# EAGLE design placa-endstops (EAGLE 9.6.0)
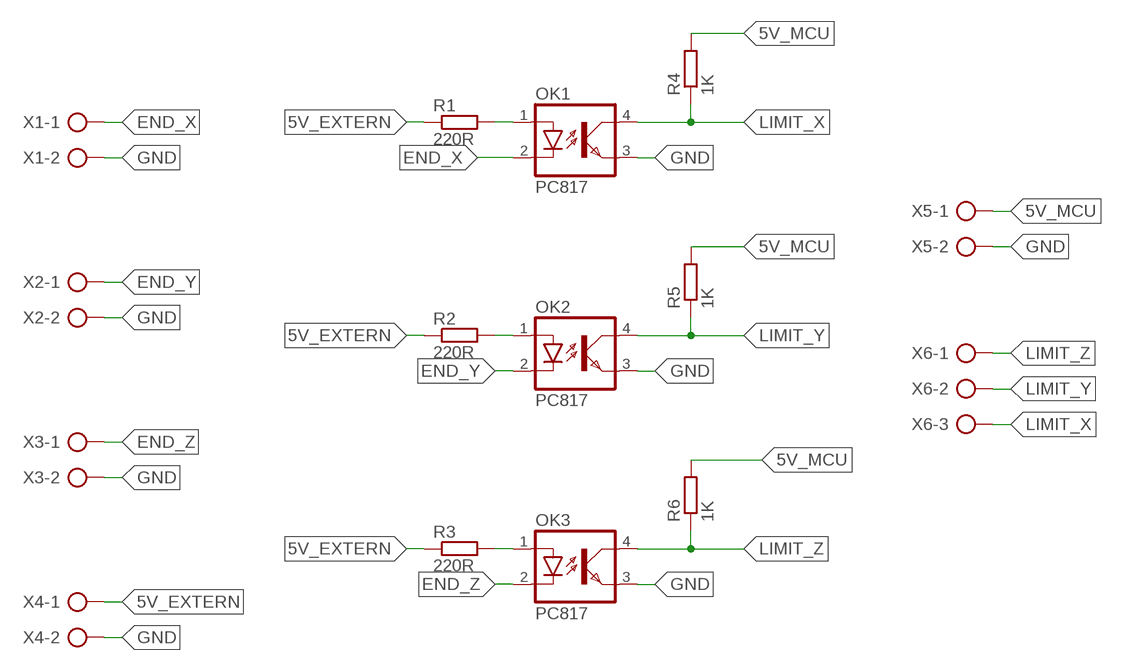
[diagram p0: schematic, sheet 1]

## Parts
OK1  PC817  [DIL04]
OK2  PC817  [DIL04]
OK3  PC817  [DIL04]
R1  220R  R-EU_0207/10  [0207/10]
R2  220R  R-EU_0207/10  [0207/10]
R3  220R  R-EU_0207/10  [0207/10]
R4  1K  R-EU_0207/10  [0207/10]
R5  1K  R-EU_0207/10  [0207/10]
R6  1K  R-EU_0207/10  [0207/10]
X1  AK500/2  [AK500/2]
X2  AK500/2  [AK500/2]
X3  AK500/2  [AK500/2]
X4  AK500/2  [AK500/2]
X5  AK500/2  [AK500/2]
X6  AK500/3  [AK500/3]

## Nets
5V_EXTERN: R1.1 R2.1 R3.1 X4.1
5V_MCU: R4.2 R5.2 R6.2 X5.1
END_X: OK1.2(C) X1.1
END_Y: OK2.2(C) X2.1
END_Z: OK3.2(C) X3.1
GND: OK1.3(EMIT) OK2.3(EMIT) OK3.3(EMIT) X1.2 X2.2 X3.2 X4.2 X5.2
LIMIT_X: OK1.4(COL) R4.1 X6.3
LIMIT_Y: OK2.4(COL) R5.1 X6.2
LIMIT_Z: OK3.4(COL) R6.1 X6.1
N$1: OK1.1(A) R1.2
N$2: OK2.1(A) R2.2
N$3: OK3.1(A) R3.2

## Library data of the parts
OK1-OK3 = optocoupler:PC817: SHARP OPTO COUPLER; MPN: PC817X4J000F; OC_FARNELL: 9707727; OC_NEWARK: 97K7059
R1-R6 = rcl:R-EU_: RESISTOR, European symbol; SPICEPREFIX: R
X1-X5 = con-ptr500:AK500/2: CONNECTOR; OC_FARNELL: unknown; OC_NEWARK: unknown
X6 = con-ptr500:AK500/3: CONNECTOR; OC_FARNELL: unknown; OC_NEWARK: unknown

## Board
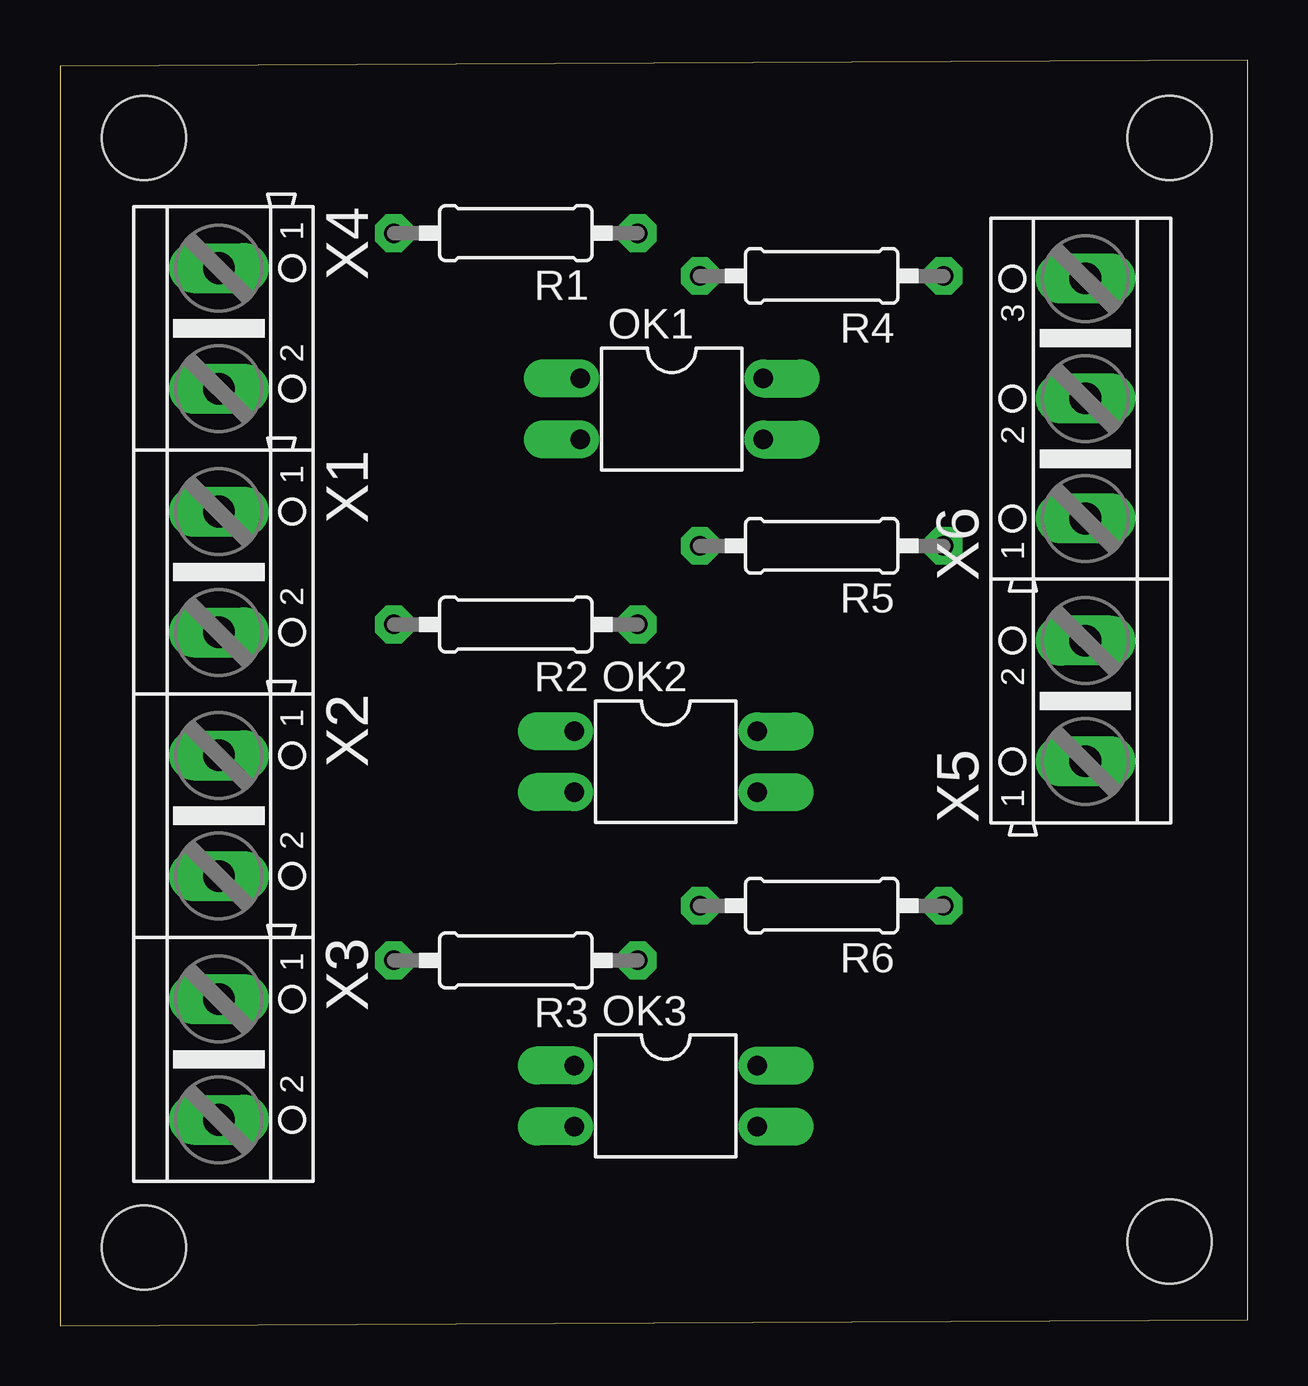
[diagram p1: board, top side]
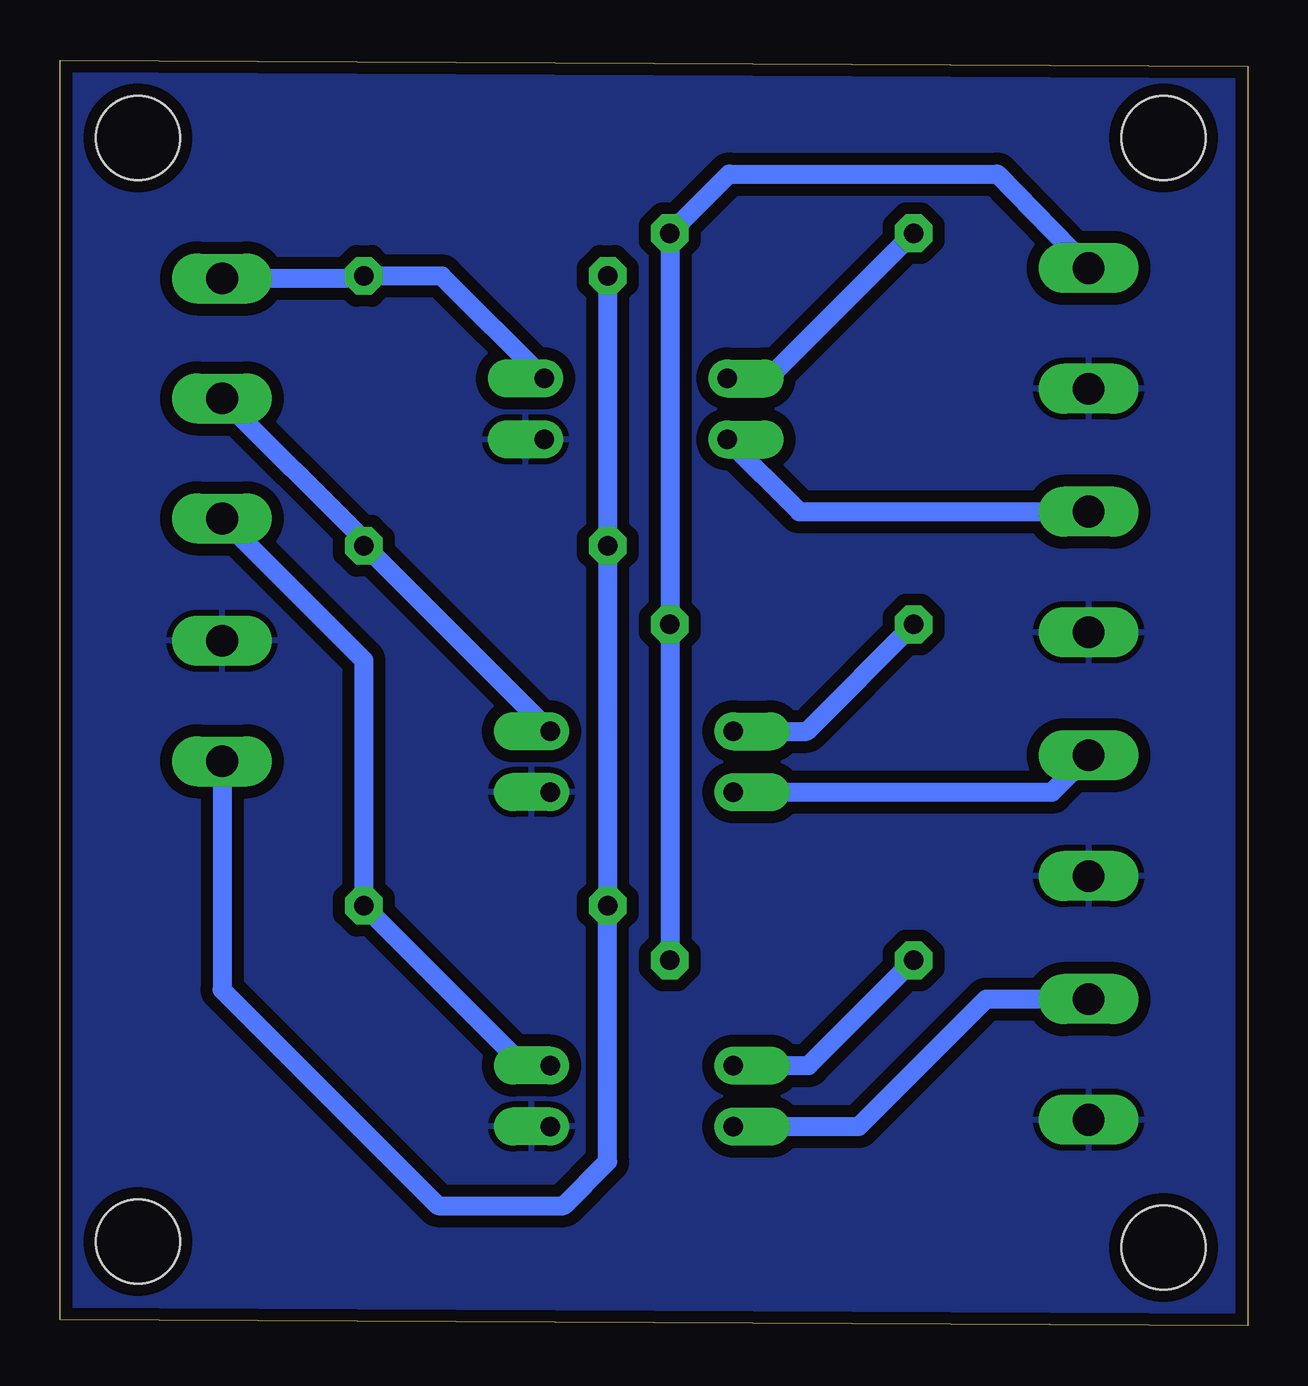
[diagram p2: board, bottom side, seen from below]

Size 49.5 x 52.75 mm. Coordinates in mm from the lower left corner, seen from the top.
Outline: 0,0 49.5,0.25 49.5,52.75 0,52.5 0,0
Copper layers (1*16): Top 0.035mm / dielectric 1.5mm / Bottom 0.035mm
Design rules "default *": minimum track width 0.8mm, minimum drill 0.8mm, track to track 0.5mm, track to pad 0.5mm, pad to pad 0.5mm, via to via 0.5mm, smd to smd 0.5mm, copper to edge 20mil, drill to drill 6mil, minimum pad ring 15mil, minimum via ring 15mil, stop-mask expansion 4mil, vias tented up to drill 0mil, thermal gap 10mil
Holes 3.5 mm at 3.5,3.25 46.25,49.5 46.25,3.5 3.5,49.5

### Footprints (pad centres in the part's own frame; a part is rotated, then mirrored left to right if it is on the bottom)
DIL04 = drill 0.813 offset: 1 -1.27,-3.81; 2 1.27,-3.81; 3 1.27,3.81; 4 -1.27,3.81
0207/10 = drill 0.813 octagon: 1 -5.08,0; 2 5.08,0
AK500/2 = drill 1.321 long: 1 -2.515,0; 2 2.515,0
AK500/3 = drill 1.321 long: 1 -5.004,0; 2 0,0; 3 5.004,0

### Placement (x,y rotation side)
OK1  25.5,38.2 270 top
OK2  25.25,23.5 270 top
OK3  25.25,9.57 270 top
R1  19,45.53 180 top
R2  19,29.22 180 top
R3  19,15.22 180 top
R4  31.75,43.75 180 top
R5  31.75,32.5 180 top
R6  31.75,17.5 180 top
X1  6.62,31.41 270 top
X2  6.62,21.25 270 top
X3  6.62,11.09 270 top
X4  6.62,41.56 270 top
X5  42.74,26.03 90 top
X6  42.74,38.64 90 top

### Tracks (layer width: path | path; a pad name or v marks a point on that pad's centre or on a via)
5V_EXTERN
  Bottom 0.8: R3.1 R2.1 R1.1 21.61,48 10.44,48 X4.1
5V_MCU
  Bottom 0.8: R4.2 R5.2 R6.2 26.67,6.83 28.5,5 33.75,5 42.74,13.99 X5.1
END_X
  Bottom 0.8: OK1.2 18.68,33.92 X1.1
END_Y
  Bottom 0.8: OK2.2 8.15,22.23 X2.1
END_Z
  Bottom 0.8: OK3.2 16.2,8.3 10.89,13.61 X3.1
GND
  pour Bottom: 0,0.25 49.5,0.25 49.5,52.75 0,52.75 0,52.5
LIMIT_X
  Bottom 0.8: OK1.4 33.59,43.75 R4.1 36.94,43.64 X6.3
LIMIT_Y
  Bottom 0.8: OK2.4 36.79,32.5 R5.1 36.83,32.73 X6.2
LIMIT_Z
  Bottom 0.8: OK3.4 30.17,10.84 R6.1 36.83,27.73 X6.1
N$1
  Bottom 0.8: R1.2 19.98,39.47 OK1.1
N$2
  Bottom 0.8: OK2.1 18.37,24.77 R2.2
N$3
  Bottom 0.8: OK3.1 18.3,10.84 R3.2